# EAGLE design VL6180_2 (EAGLE 8.4.3)
CNAME: Simulacare; CREVISION: 1.0.0; DESIGNER: Rinaldo
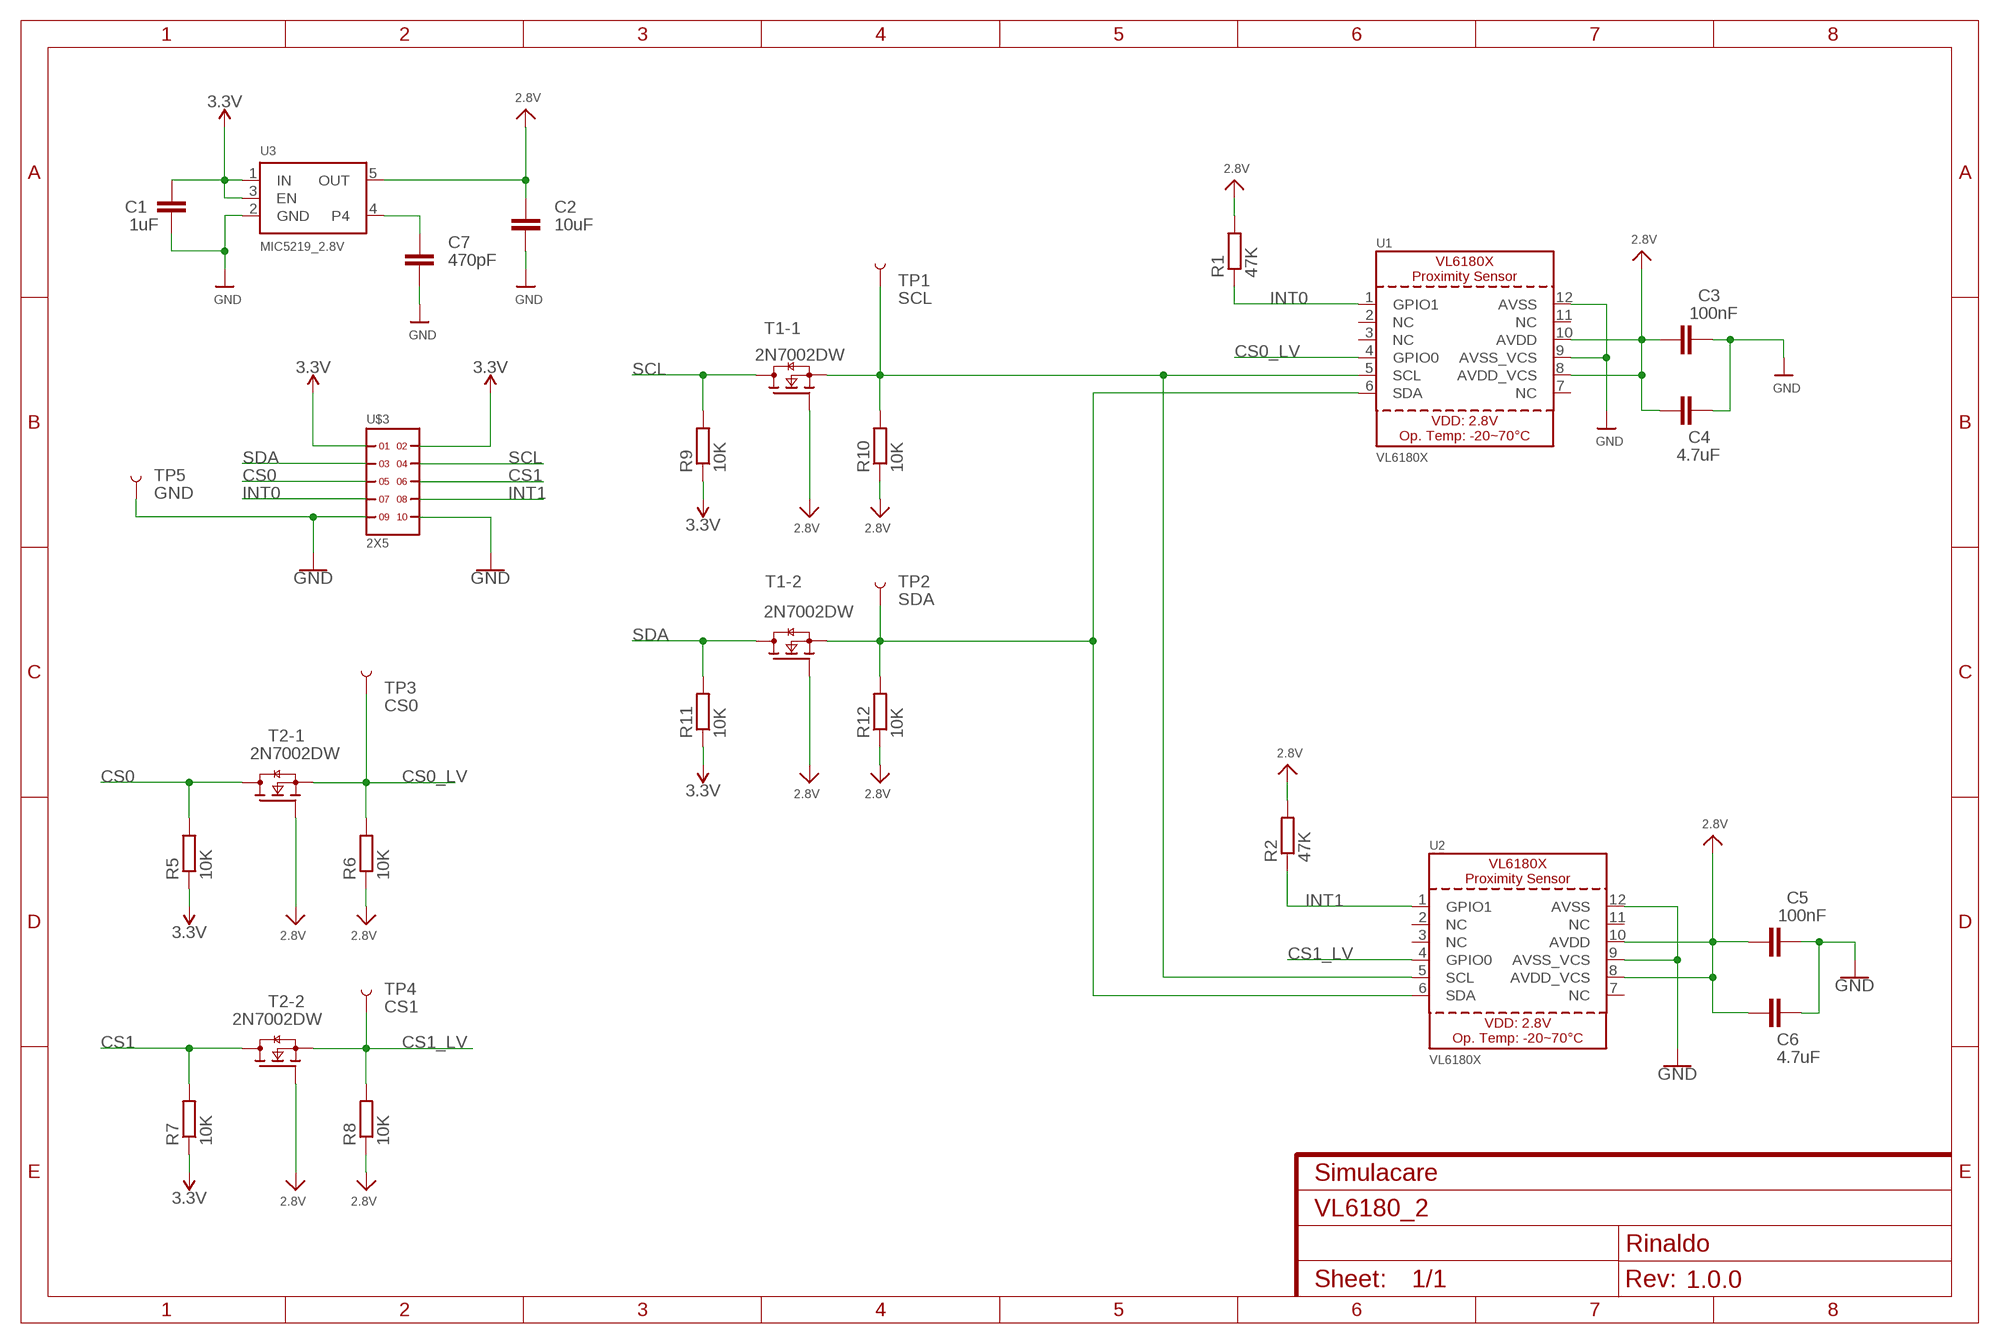
[diagram p0: schematic, sheet 1]

## Parts
C1  1uF  C-EUC0603  [C0603]
C2  10uF  C-EUC0603  [C0603]
C3  100nF  C-EUC0603  [C0603]
C4  4.7uF  C-EUC0603  [C0603]
C5  100nF  C-EUC0603  [C0603]
C6  4.7uF  C-EUC0603  [C0603]
C7  470pF  C-EUC0603  [C0603]
R1  47K  R-EU_R0603  [R0603]
R2  47K  R-EU_R0603  [R0603]
R5  10K  R-EU_R0603  [R0603]
R6  10K  R-EU_R0603  [R0603]
R7  10K  R-EU_R0603  [R0603]
R8  10K  R-EU_R0603  [R0603]
R9  10K  R-EU_R0603  [R0603]
R10  10K  R-EU_R0603  [R0603]
R11  10K  R-EU_R0603  [R0603]
R12  10K  R-EU_R0603  [R0603]
T1  2N7002DW  2N7002BKS  [SOT363]
T2  2N7002DW  2N7002BKS  [SOT363]
TP1  SCL  TEST-POINT3X4  [PAD.03X.04]
TP2  SDA  TEST-POINT3X4  [PAD.03X.04]
TP3  CS0  TEST-POINT3X4  [PAD.03X.04]
TP4  CS1  TEST-POINT3X4  [PAD.03X.04]
TP5  GND  TEST-POINT3X4  [PAD.03X.04]
U1  VL6180X  [VL6180]
U2  VL6180X  [VL6180]
U3  MIC5219_2.8V  VREG_SOT23-5  [SOT23-5]
U$3  2X5  [2X5]

## Nets
2.8V: C2.1 C3.1 C4.1 C5.1 C6.1 R1.2 R2.2 R6.1 R8.1 R10.1 R12.1 T1.2(-1:G) T1.5(-2:G) T2.2(-1:G) T2.5(-2:G) U1.8(AVDD_VCS) U1.10(AVDD) U2.8(AVDD_VCS) U2.10(AVDD) U3.5(OUT)
3.3V: C1.1 R5.1 R7.1 R9.1 R11.1 U3.1(IN) U3.3(EN) U$3.1 U$3.2
CS0: R5.2 T2.6(-1:D) U$3.5
CS0_LV: R6.2 T2.1(-1:S) TP3.P$1 U1.4(GPIO0)
CS1: R7.2 T2.3(-2:D) U$3.6
CS1_LV: R8.2 T2.4(-2:S) TP4.P$1 U2.4(GPIO0)
GND: C1.2 C2.2 C3.2 C4.2 C5.2 C6.2 C7.2 TP5.P$1 U1.9(AVSS_VCS) U1.12(AVSS) U2.9(AVSS_VCS) U2.12(AVSS) U3.2(GND) U$3.9 U$3.10
INT0: R1.1 U1.1(GPIO1) U$3.7
INT1: R2.1 U2.1(GPIO1) U$3.8
N$2: C7.1 U3.4
N$5: R10.2 T1.1(-1:S) TP1.P$1 U1.5(SCL) U2.5(SCL)
N$9: R12.2 T1.4(-2:S) TP2.P$1 U1.6(SDA) U2.6(SDA)
SCL: R9.2 T1.6(-1:D) U$3.4
SDA: R11.2 T1.3(-2:D) U$3.3
Unconnected: U1.2(NC) U1.3(NC) U1.7(NC) U1.11(NC) U2.2(NC) U2.3(NC) U2.7(NC) U2.11(NC)

## Library data of the parts
C1-C7 = resistor:C-EU: CAPACITOR, European symbol
R1 R2 R5-R12 = resistor:R-EU_: RESISTOR, European symbol
T1 T2 = nxp_60:2N7002BK: 60 V, 340 mA dual N-channel Trench MOSFET Dual N-channel enhancement mode Field-Effect Transistor (FET) in an ultra small SOT666 Surface-Mounted Device (SMD) plastic package using Trench MOSFET technology. AAL Eindhoven MK
TP1-TP5 = SparkFun-Connectors:TEST-POINT: SparkFun Test Points Bare copper test points for troubleshooting or In-Circuit-Testing. These are used by our Production team for verifying production board runs using pogo-pins on test beds. SparkFun Products: SparkFun LSM9DS1 Breakout <https://www.sparkfun.com/products/13284> SparkFun PSOC <https://www.sparkfun.com/products/13714> SparkFun Load Cell Amplifier <https://www.sparkfun.com/products/13879>
U1 U2 = microbuilder:VL6180X: VL6180x Proximity and Light Sensor with Gesture Recognition Supply Level: 2.8V (3.0V Max!) Range: 0-10cm Light Sensor: 0..100K Lux (16-bit output) IR emitter: 850 nm I2C Address: 0x29 (7-bit)
U3 = microbuilder:VREG_SOT23-5: SOT23-5 Fixed Voltage Regulators Part Current Out V Out V In V Dropout θJA (°C/W) TJ (°C) Digikey Part No. ADP121 150mA 3.3V 3.4-5.5V 0.09V @ 150mA -- -- ADP121-AUJZ33R7CT-ND ADP121 150mA 3.0V 3.1-5.5V 0.09V @ 150mA -- -- ADP121-AUJZ30R7CT-ND ADP122 300mA 3.3V 3.4-5.5V 0.085V @ 300mA -- -- ADP122AUJZ-3.3-R7CT-ND ADP1712 300mA 3.3V 3.5-5.5V 0.17V @ 300mA -- -- ADP1712AUJZ-3.3-R7TR-ND AP7311 (Low Cost) 150mA 3.3V 3.5-6V 0.15V @ 150mA -- -- AP7311-33WG-7DICT-ND LD39015M18R 150mA 1.8V 1.9V-5.5V 0.08V @ 100mA -- -- 497-6977-1-ND LP2985A-33DBVR 150mA 3.3V 3.3-16V 0.28V @ 150mA 206 150 296-18479-1-ND MCP1824T-3302E/OT 300mA 3.3V 3.5V-6V 0.2V @ 300mA -- -- MCP1824T-3302E/OTCT-ND MIC5205-2.5YM5 TR 150mA 2.5V 2.7-16V 0.165V @ 150mA -- -- 576-1257-2-ND MIC5205-3.0YM5 TR 150mA 3.0V 3.2V-16V 0.165V @ 150mA -- -- 576-1258-2-ND MIC5205-3.3YM5 TR 150mA 3.3V 3.5V-16V 0.165V @ 150mA -- -- 576-1259-2-ND TPS780330220 150mA 3.3V+2.2V 3.6-5.5V 250mV Max -- -- 296-23332-1-ND TDA3663/N1,135 100mA 3.3V 3.5-45V 0.18V @ 50mA -- -- 568-5343-1-ND Max operating temp can be calculated using θJA, TJ (max junction temperature), and power in watts. Set the "Maximum Ambient Temperature" until it reaches TJ ("Max Junction Temperature"), which is the absolute limit for safe use of the regulator: Heat Sink Temperature Calculator <http://www.daycounter.com/Calculators/Heat-Sink-Temperature-Calculator.phtml> For example, With 12V source into a 3.3V LP2985 and a 30mA load, we are dissipating (12V-3.3V) * 0.03A = 0.261W. With a θJA of 206 °C/W, a TJ of 150°C, and 261mW we can safely use the chip without a heat sink up to 75°C (=147.1°C Junction Temperature).
U$3 = headers(2mm)(samtec):2X5

## Board
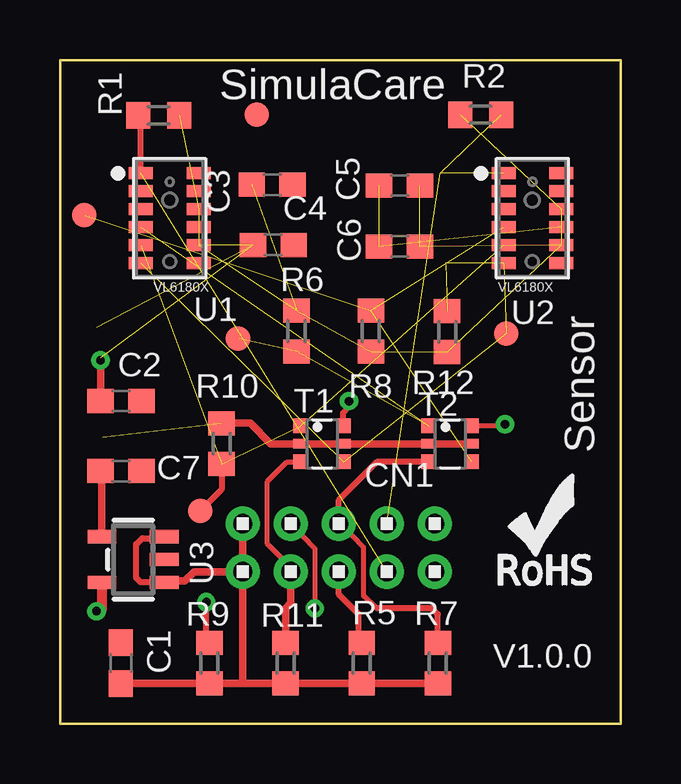
[diagram p1: board, top side]
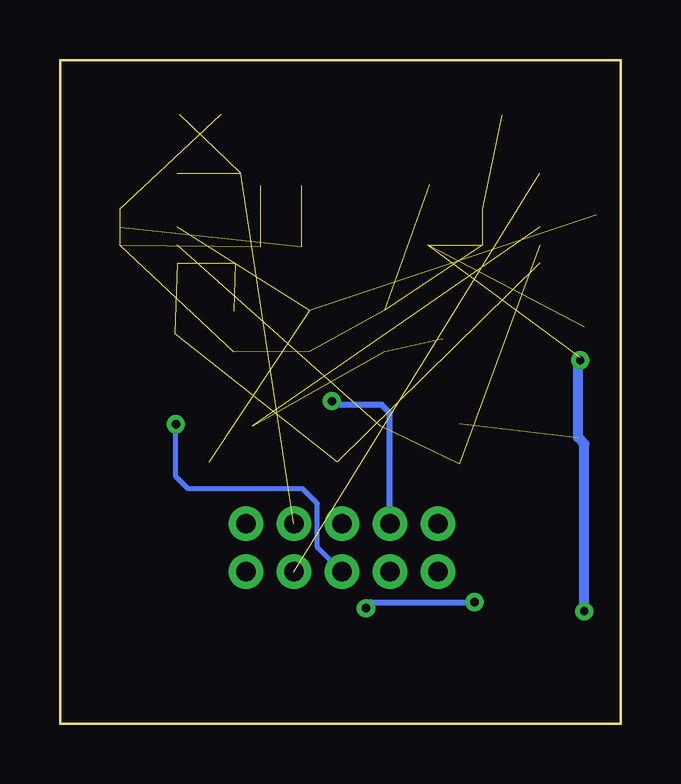
[diagram p2: board, bottom side, seen from below]

Size 23.37 x 27.69 mm. Coordinates in mm from the lower left corner, seen from the top.
Outline: 23.29,27.68 0,27.68 0,0
Outline: 23.37,0 0,0
Outline: 23.37,0 23.37,27.69 0,27.69 0,0
Outline: 23.37,0 0,0
Copper layers (1*16): Top 0.035mm / dielectric 1.5mm / Bottom 0.035mm
Design rules "default *": minimum track width 8mil, minimum drill 0.35mm, track to track 12mil, track to pad 12mil, pad to pad 12mil, via to via 12mil, smd to smd 12mil, copper to edge 20mil, drill to drill 10mil, minimum pad ring 10mil, minimum via ring 8mil, stop-mask expansion 4mil, vias tented up to drill 0mil, thermal gap 10mil

### Footprints (pad centres in the part's own frame; a part is rotated, then mirrored left to right if it is on the bottom)
C0603 = smd 1.1 x 1: 1 -0.85,0; 2 0.85,0
R0603 = smd 1 x 1.1: 1 -0.85,0; 2 0.85,0
SOT363 = smd 0.6 x 0.6: 1 -0.75,-0.9; 3 0.75,-0.9; 4 0.75,0.9; 6 -0.75,0.9 | smd 0.4 x 0.6: 2 0,-0.9; 5 0,0.9
PAD.03X.04 = smd 1.016 x 1.016: P$1 0,0
VL6180 = smd 1 x 0.5: 1 -1.2,1.875; 2 -1.2,1.125; 3 -1.2,0.375; 4 -1.2,-0.375; 5 -1.2,-1.125; 6 -1.2,-1.875; 7 1.2,-1.875; 8 1.2,-1.125; 9 1.2,-0.375; 10 1.2,0.375; 11 1.2,1.125; 12 1.2,1.875
SOT23-5 = smd 0.55 x 1.2: 1 -0.95,-1.3; 2 0,-1.3; 3 0.95,-1.3; 4 0.95,1.3; 5 -0.95,1.3
2X5 = drill 0.8 pad 1.422: 1 0,0; 2 0,2; 3 2,0; 4 2,2; 5 4,0; 6 4,2; 7 6,0; 8 6,2; 9 8,0; 10 8,2

### Placement (x,y rotation side)
C1  2.54,2.54 90 top
C2  2.54,13.46 0 top
C3  8.84,22.48 0 top
C4  8.89,19.96 0 top
C5  14.15,22.45 180 top
C6  14.15,19.91 180 top
C7  2.54,10.54 0 top
R1  4.11,25.37 0 top
R2  17.53,25.4 180 top
R5  12.57,2.54 90 top
R6  9.86,16.38 270 top
R7  15.75,2.54 90 top
R8  12.95,16.38 90 top
R9  6.22,2.54 90 top
R10  6.73,11.68 270 top
R11  9.4,2.54 90 top
R12  16.13,16.36 90 top
T1  10.92,11.68 270 top
T2  16.26,11.68 270 top
TP1  5.84,8.89 0 top
TP2  18.59,16.28 0 top
TP3  7.42,16.08 0 top
TP4  1.02,21.21 0 top
TP5  8.2,25.4 0 top
U1  4.57,21.08 0 top
U2  19.68,21.08 0 top
U3  3.05,6.86 90 top
U$3  7.62,6.35 0 top
U$20  [ROHS_LOGO_0.18_IN]  18.06,5.69 0 top

### Tracks (layer width: path | path; a pad name or v marks a point on that pad's centre or on a via)
2.8V  (via drill 0.35)  (15 unrouted)
  Top 0.254: 6.82,12.45 R10.1 | 1.71,15.15 v1.69,15.17
  Top 0.305: 1.69,14.98 v1.69,15.17 1.69,15.29 1.74,15.24 1.83,15.15 | C2.1 1.69,14.98 | 1.69,14.99 1.69,14.98 | T2.5 T2.2 T1.5 T1.2 8.79,11.68 7.92,12.55 6.75,12.55 R10.1 | 1.65,4.7 v1.52,4.7
  Top 0.406: U3.5 1.75,4.8 1.65,4.7
  Bottom 0.305: 1.78,14.99 1.65,15.11 1.65,15.13 v1.69,15.17
  Bottom 0.406: v1.52,4.7 1.52,11.68 1.78,11.94 1.78,14.99
3.3V
  Top 0.254: U3.1 3.36,5.91 3.17,6.1 3.17,7.49 3.43,7.75 4.29,7.75 U3.3
  Top 0.305: C1.1 R9.1 7.65,1.69 | 7.65,1.69 R11.1 R5.1 R7.1 | U$3.2 U$3.1 | U$3.1 7.62,1.72 7.65,1.69 | U$3.1 5.59,6.35 5.21,5.97 4.41,5.97 U3.1
CS0  (via drill 0.35)
  Top 0.203: v18.54,12.5 18.48,12.43 T2.6
  Top 0.254: R5.2 12.45,3.52 12.45,4.57 11.62,5.4 U$3.5
  Bottom 0.203: U$3.5 12.65,7.38 12.65,9.2 13.26,9.8 18.03,9.8 18.54,10.31 v18.54,12.5
CS0_LV  (3 unrouted)
CS1
  Top 0.203: 13.21,4.83 12.65,5.33 12.65,7.37 11.72,8.35 U$3.6
  Top 0.254: T2.3 15.34,10.92 13.21,10.92 11.62,9.33 U$3.6 | R7.2 15.75,4.57 15.49,4.83 13.21,4.83
CS1_LV  (3 unrouted)
GND  (2 unrouted)
INT0  (1 unrouted)
  Top 0.254: U1.1 3.37,25.27 R1.1
  Bottom 0.305: U$3.7
INT1  (3 unrouted)
N$2
  Top 0.254: C7.1 1.52,10.38
  Top 0.305: U3.4 1.75,10.48 C7.1
N$5  (3 unrouted)
  Top 0.254: R10.2 6.73,9.78 TP1.P$1
N$9  (5 unrouted)
SCL  (via drill 0.35)
  Top 0.203: U$3.4 10.62,7.3 v10.62,4.83
  Top 0.254: R9.2 6.1,3.52 v6.1,5.08 | v12.04,13.46 12.04,13.21 11.79,12.95 11.79,12.47 T1.6
  Bottom 0.203: v10.62,4.83 10.41,5.08
  Bottom 0.254: 10.41,5.08 v6.1,5.08 | 9.65,8.38 U$3.4 9.62,12.97 9.96,13.31 11.84,13.31 11.89,13.26 11.89,13.31 v12.04,13.46
SDA
  Top 0.203: 9.62,6.53 8.64,7.52 8.64,10.11 9.45,10.92 T1.3
  Top 0.254: U$3.3 9.62,6.53 | T1.3
  Top 0.305: R11.2 9.4,4.83 9.62,5.05 U$3.3

### Text on the board
tPlace: SimulaCare | Sensor | CN1 | V1.0.0